# EAGLE design DCSTICK (EAGLE 9.6.2)
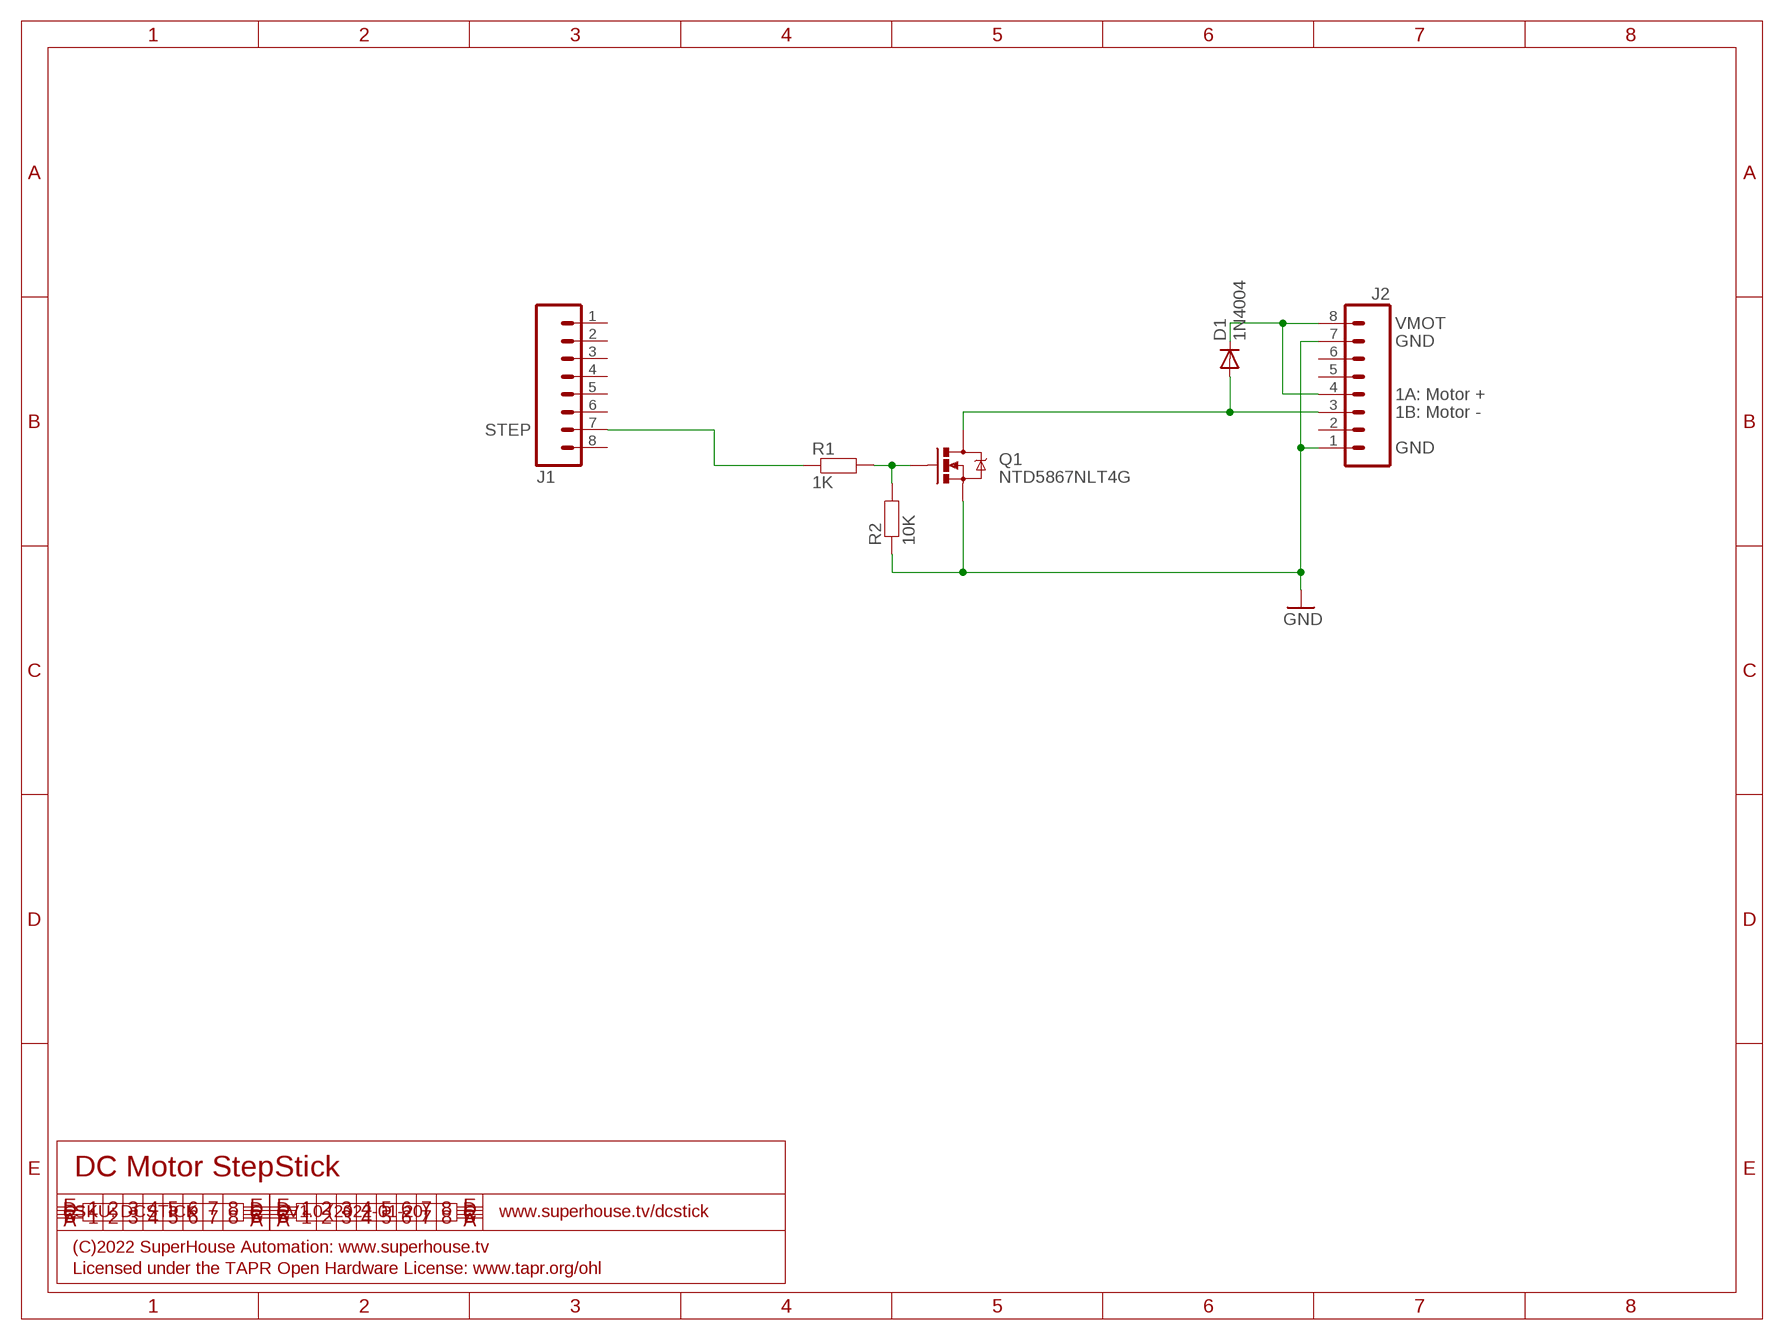
[diagram p0: schematic, sheet 1]

## Parts
D1  1N4004  DIODESMA  [SMA-DIODE]
J1  M08-PIN-BELOW  [1X08-P-BELOW]
J2  M08-PIN-BELOW  [1X08-P-BELOW]
Q1  NTD5867NLT4G  MOSFET-NCHANNEL-DPAK  [DPACK]
R1  1K  RESISTOR0603  [R0603]
R2  10K  RESISTOR0603  [R0603]

## Nets
GND: J2.1 J2.7 Q1.3(S) R2.1
N$1: J1.7 R1.1
N$2: Q1.1(G) R1.2 R2.2
N$3: D1.C J2.4 J2.8
N$4: D1.A J2.3 Q1.2(D)
Unconnected: J1.1 J1.2 J1.3 J1.4 J1.5 J1.6 J1.8 J2.2 J2.5 J2.6

## Notes on the sheet
- VMOT
- GND
- 1A: Motor +
- 1B: Motor -
- STEP
- GND
- DC Motor StepStick
- SKU: DCSTICK | V1.0 (2022-01-20) | www.superhouse.tv/dcstick
- (C)2022 SuperHouse Automation: www.superhouse.tv
- Licensed under the TAPR Open Hardware License: www.tapr.org/ohl

## Library data of the parts
D1 = SuperHouse-Diodes:DIODE: Diode Standard reverse protection diodes and small signal diodes. SMA package can handle up to about 1A. SOD-323 can handle about 200mA.
J1 J2 = SuperHouse-Connectors:M08: 8-way header Standard 1x8 header, and screw terminal variations
Q1 = SuperHouse-Transistors:MOSFET-NCHANNEL: N-channel MOSFET
R1 R2 = SuperHouse-Resistors:RESISTOR: Resistors in both surface-mount and through-hole versions.

## Board
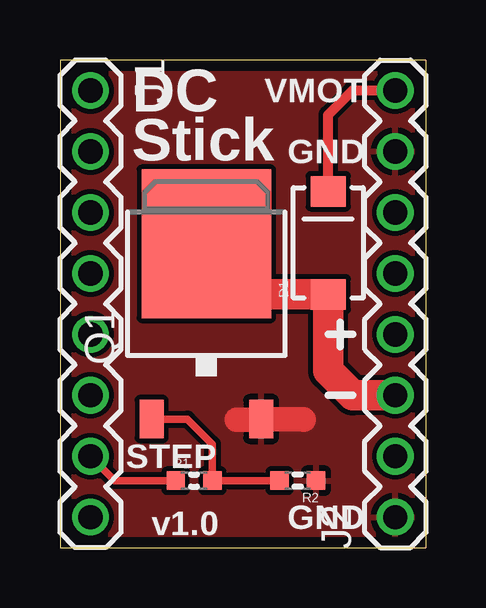
[diagram p1: board, top side]
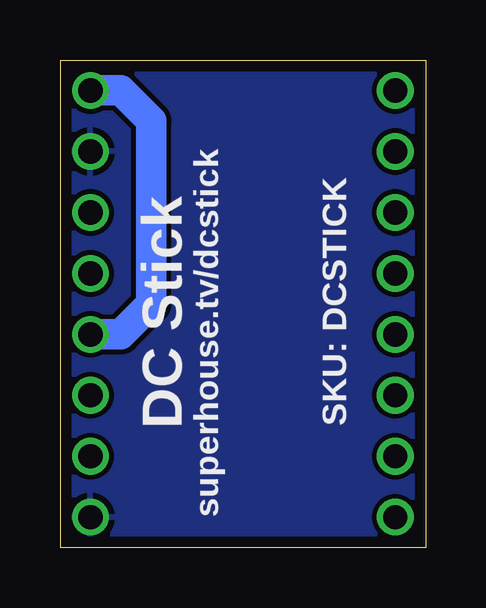
[diagram p2: board, bottom side, seen from below]

Size 15.24 x 20.32 mm. Coordinates in mm from the lower left corner, seen from the top.
Outline: 15.24,20.32 0,20.32 0,0 15.24,0 15.24,20.32
Copper layers (1*16): Top 0.035mm / dielectric 1.5mm / Bottom 0.035mm
Design rules "SuperHouse-Design-Rules *": minimum track width 10mil, minimum drill 24mil, track to track 8mil, track to pad 8mil, pad to pad 8mil, via to via 8mil, smd to smd 6mil, copper to edge 18mil, drill to drill 8mil, minimum pad ring 7mil, minimum via ring 8mil, stop-mask expansion 4mil, vias tented up to drill 0.5mm, thermal gap 10mil

### Footprints (pad centres in the part's own frame; a part is rotated, then mirrored left to right if it is on the bottom)
SMA-DIODE = smd 1.27 x 1.47: A -2.15,0; C 2.15,0
1X08-P-BELOW = drill 1.016: 1 -8.89,0; 2 -6.35,0; 3 -3.81,0; 4 -1.27,0; 5 1.27,0; 6 3.81,0; 7 6.35,0; 8 8.89,0
DPACK = smd 1 x 1.6: 1 -2.28,-4.8; 3 2.28,-4.8 | smd 5.4 x 6.2: 2 0,2.5
R0603 = smd 0.762 x 0.762: 1 -0.762,0; 2 0.762,0

### Placement (x,y rotation side)
D1  11.18,12.7 90 top
J1  1.27,10.16 270 top
J2  13.97,10.16 90 top
Q1  6.1,10.16 0 top
R1  5.59,2.79 0 top
R2  9.91,2.79 180 top

### Tracks (layer width: path | path; a pad name or v marks a point on that pad's centre or on a via)
GND
  Top 1.016: 10.16,5.33 10.13,5.36 Q1.3 8.35,5.33 7.37,5.33
  pour Bottom: 15.24,20.32 15.24,0 0,0 0,20.32
  pour Top: 15.24,0 0,0 0,20.32 15.24,20.32
N$1
  Top 0.305: R1.1 2.29,2.79 J1.7
N$2
  Top 0.305: Q1.1 5.31,5.36 6.35,4.32 R1.2 R2.2
N$3
  Top 0.406: D1.C 11.18,18.03 12.19,19.05 J2.8
  Bottom 1.27: J2.8 12.7,19.05 11.43,17.78 11.43,10.16 12.7,8.89 J2.4
N$4
  Top 1.27: J2.3 12.19,6.35 11.18,7.37 D1.A 7.23,10.55 6.1,11.68 Q1.2

### Text on the board
tPlace: VMOT | DC / Stick | GND | STEP | v1.0 | GND
bPlace: SKU: DCSTICK | DC Stick | superhouse.tv/dcstick